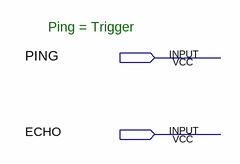
[diagram p0: schematic sheet]
// Quartus schematic measure_ultrasonic_sensor_time_interval.bdf as structural Verilog: 0 symbols, 2 pins
module measure_ultrasonic_sensor_time_interval (
  input  PING,
  input  ECHO
);


  // Notes on the sheet:
  //   Ping = Trigger
endmodule
